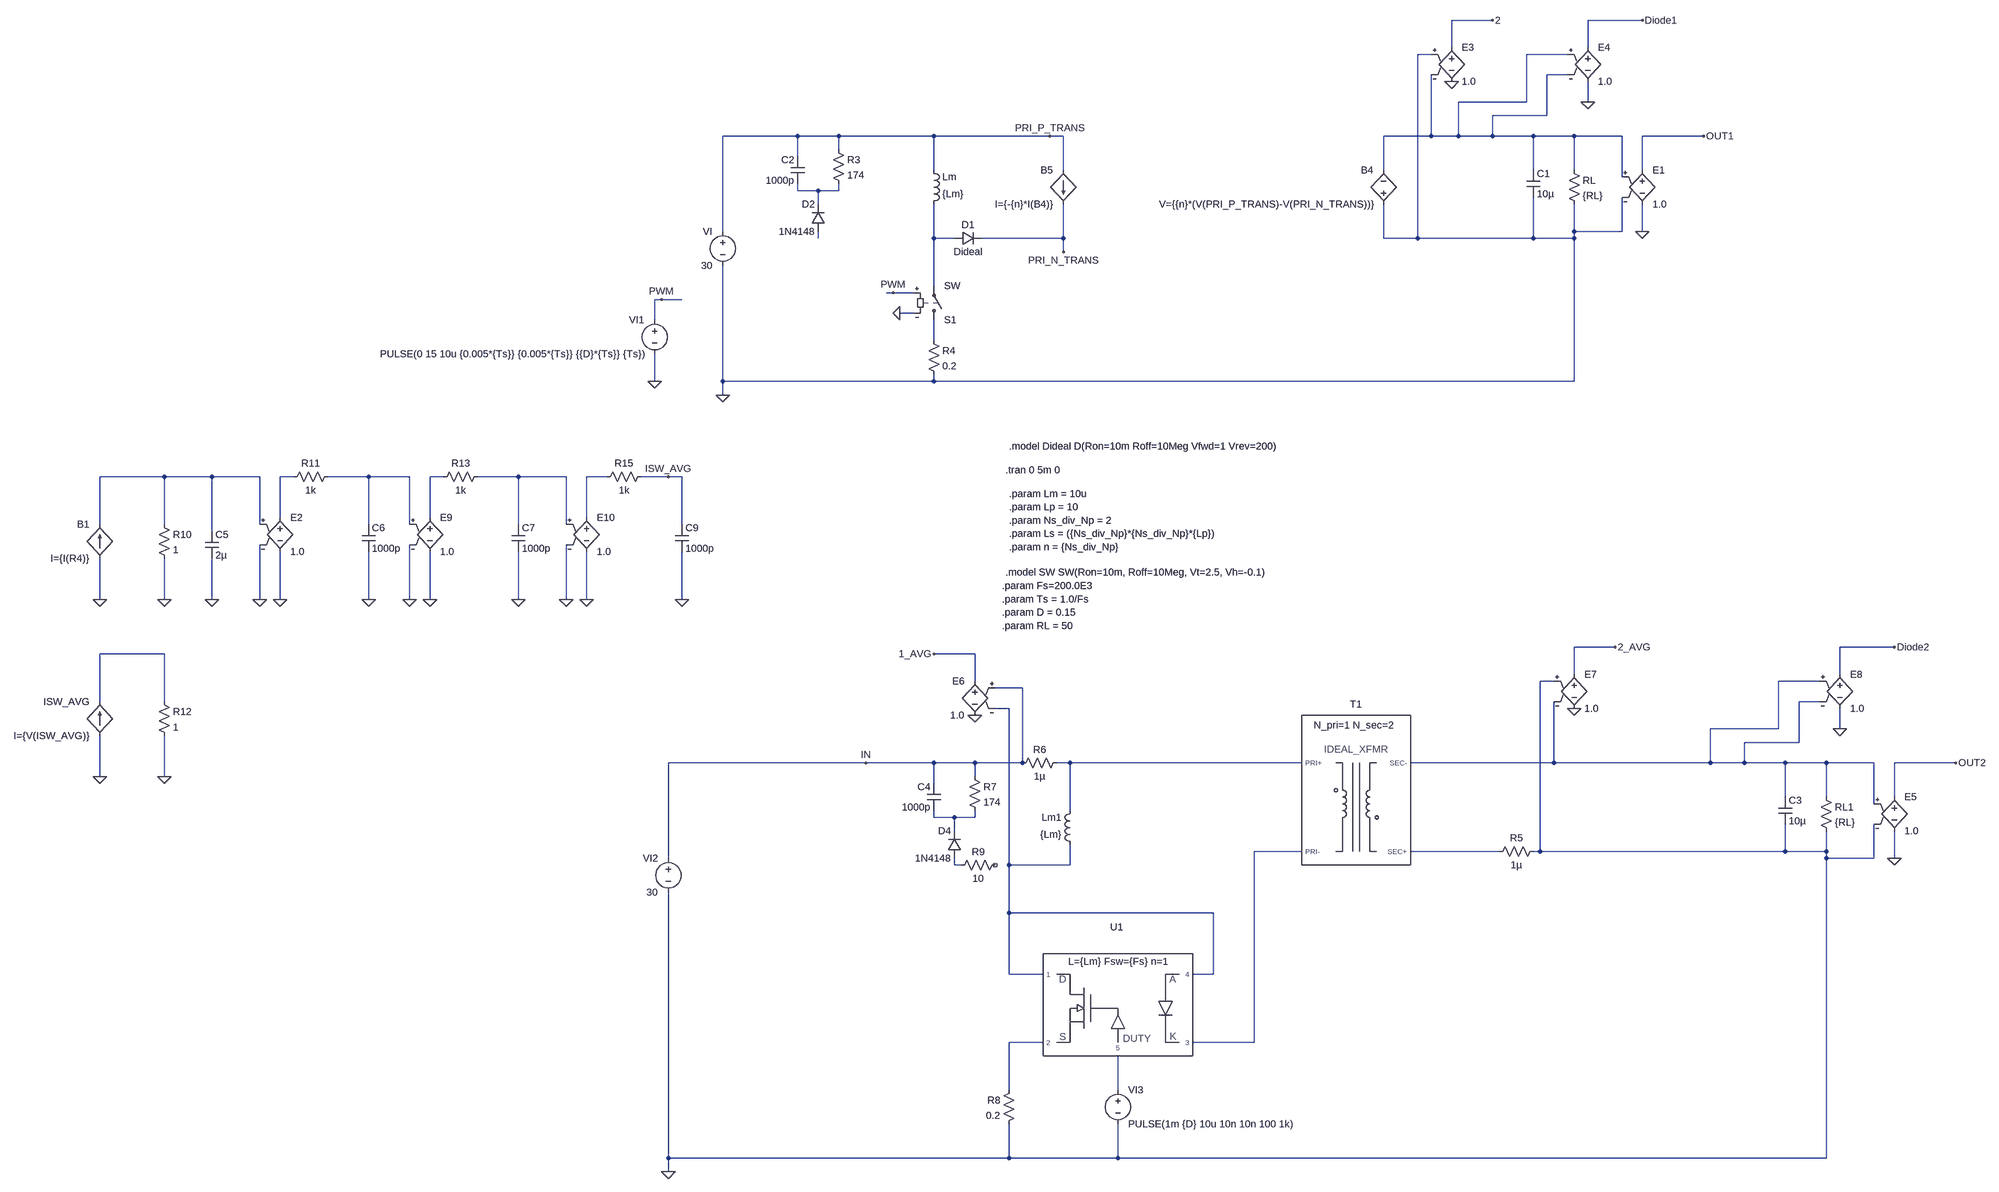
[diagram p0: schematic Flyback_Basic_Model_Diode_Moved_to_Primary_Side.asc]
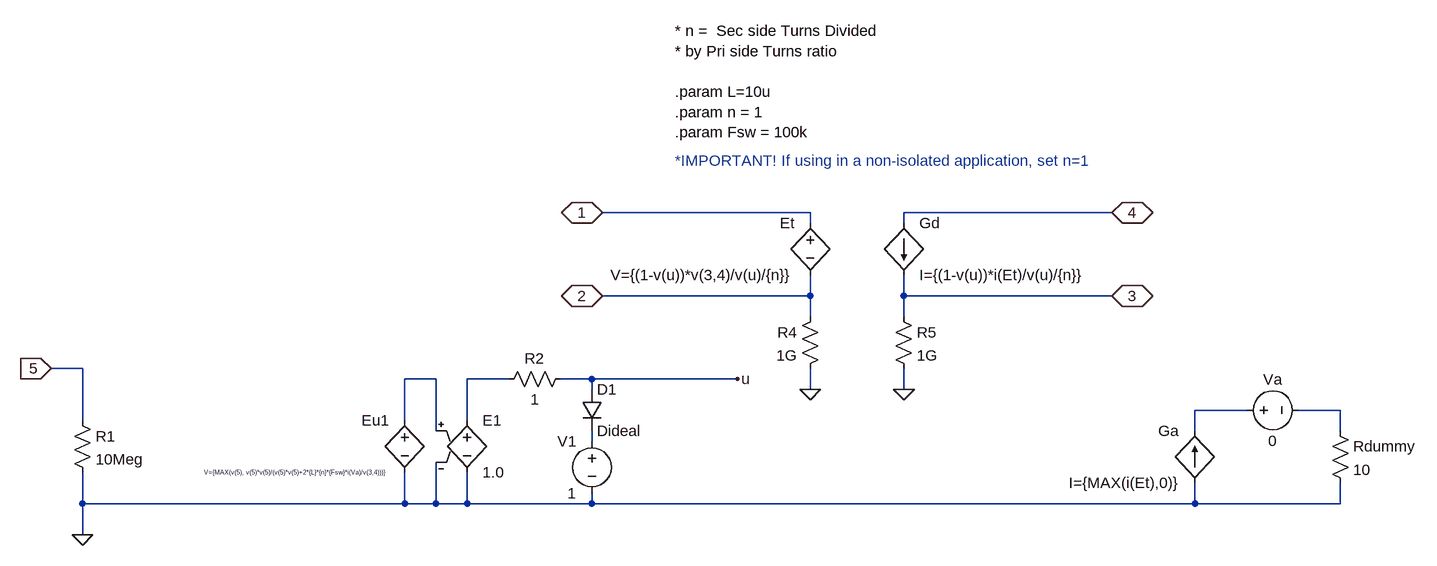
[diagram p1: sub-circuit ccm-dcm2.asc]
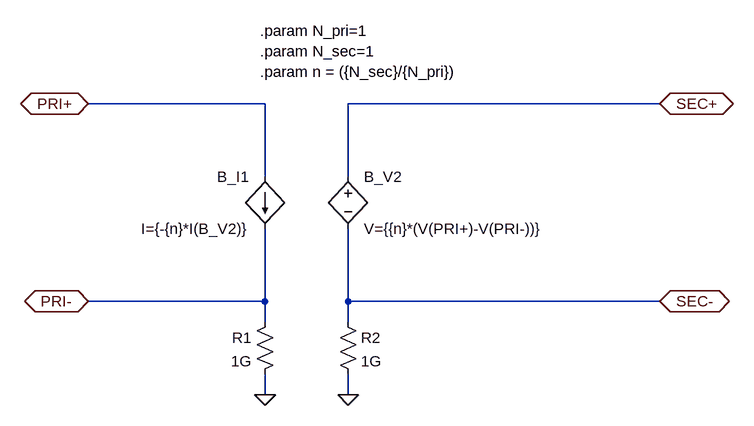
[diagram p2: sub-circuit ideal_dc_xfmr_alt.asc]
Flyback_Basic_Model_Diode_Moved_to_Primary_Side.asc, the LTspice schematic file:
Version 4.1
SHEET 1 2000 3524
WIRE 832 -288 736 -288
WIRE 1184 -288 1056 -288
WIRE 736 -224 736 -288
WIRE 1056 -224 1056 -288
WIRE 688 -208 656 -208
WIRE 1008 -208 912 -208
WIRE 1008 -160 960 -160
WIRE 912 -96 912 -208
WIRE 912 -96 752 -96
WIRE 1056 -96 1056 -144
WIRE 960 -64 960 -160
WIRE 960 -64 832 -64
WIRE -800 -16 -976 -16
WIRE -704 -16 -800 -16
WIRE -480 -16 -704 -16
WIRE -208 -16 -480 -16
WIRE -176 -16 -208 -16
WIRE 688 -16 688 -160
WIRE 688 -16 576 -16
WIRE 752 -16 752 -96
WIRE 752 -16 688 -16
WIRE 832 -16 832 -64
WIRE 832 -16 752 -16
WIRE 928 -16 832 -16
WIRE 1024 -16 928 -16
WIRE 1136 -16 1024 -16
WIRE 1328 -16 1184 -16
WIRE -704 16 -704 -16
WIRE -800 32 -800 -16
WIRE -480 64 -480 -16
WIRE -176 64 -176 -16
WIRE 576 64 576 -16
WIRE 928 64 928 -16
WIRE 1024 64 1024 -16
WIRE 1184 64 1184 -16
WIRE 1136 80 1136 -16
WIRE -800 112 -800 96
WIRE -752 112 -800 112
WIRE -704 112 -704 96
WIRE -704 112 -752 112
WIRE -752 144 -752 112
WIRE -976 208 -976 -16
WIRE 1024 208 1024 144
WIRE 1136 208 1136 128
WIRE 1136 208 1024 208
WIRE 1184 208 1184 144
WIRE -752 224 -752 208
WIRE -480 224 -480 144
WIRE -432 224 -480 224
WIRE -176 224 -176 144
WIRE -176 224 -368 224
WIRE 576 224 576 144
WIRE 656 224 656 -208
WIRE 656 224 576 224
WIRE 928 224 928 128
WIRE 928 224 656 224
WIRE 1024 224 1024 208
WIRE 1024 224 928 224
WIRE -176 256 -176 224
WIRE -480 336 -480 224
WIRE -576 352 -592 352
WIRE -528 352 -576 352
WIRE -1120 368 -1136 368
WIRE -1072 368 -1120 368
WIRE -528 400 -560 400
WIRE -1136 416 -1136 368
WIRE -480 464 -480 416
WIRE -1136 560 -1136 496
WIRE -976 560 -976 288
WIRE -480 560 -480 544
WIRE -480 560 -976 560
WIRE 1024 560 1024 224
WIRE 1024 560 -480 560
WIRE -976 592 -976 560
WIRE -2288 784 -2448 784
WIRE -2176 784 -2288 784
WIRE -2064 784 -2176 784
WIRE -1984 784 -2016 784
WIRE -1808 784 -1904 784
WIRE -1712 784 -1808 784
WIRE -1632 784 -1664 784
WIRE -1456 784 -1552 784
WIRE -1344 784 -1456 784
WIRE -1248 784 -1296 784
WIRE -1104 784 -1168 784
WIRE -1072 784 -1104 784
WIRE -2016 880 -2016 784
WIRE -1664 880 -1664 784
WIRE -1296 880 -1296 784
WIRE -2448 896 -2448 784
WIRE -2288 896 -2288 784
WIRE -2064 896 -2064 784
WIRE -1808 896 -1808 784
WIRE -1712 896 -1712 784
WIRE -1456 896 -1456 784
WIRE -1344 896 -1344 784
WIRE -1072 896 -1072 784
WIRE -2176 912 -2176 784
WIRE -2448 1072 -2448 976
WIRE -2288 1072 -2288 976
WIRE -2176 1072 -2176 976
WIRE -2064 1072 -2064 944
WIRE -2016 1072 -2016 960
WIRE -1808 1072 -1808 960
WIRE -1712 1072 -1712 944
WIRE -1664 1072 -1664 960
WIRE -1456 1072 -1456 960
WIRE -1344 1072 -1344 944
WIRE -1296 1072 -1296 960
WIRE -1072 1072 -1072 960
WIRE 1120 1184 1024 1184
WIRE 1776 1184 1648 1184
WIRE -2288 1200 -2448 1200
WIRE -384 1200 -480 1200
WIRE 1024 1248 1024 1184
WIRE 1648 1248 1648 1184
WIRE -384 1264 -384 1200
WIRE 976 1264 944 1264
WIRE 1600 1264 1504 1264
WIRE -272 1280 -336 1280
WIRE -2448 1312 -2448 1200
WIRE -2288 1312 -2288 1200
WIRE 1600 1312 1552 1312
WIRE -304 1328 -336 1328
WIRE 1504 1376 1504 1264
WIRE 1504 1376 1344 1376
WIRE 1648 1376 1648 1328
WIRE 1552 1408 1552 1312
WIRE 1552 1408 1424 1408
WIRE -640 1456 -1104 1456
WIRE -480 1456 -640 1456
WIRE -384 1456 -480 1456
WIRE -272 1456 -272 1280
WIRE -272 1456 -384 1456
WIRE -160 1456 -192 1456
WIRE 384 1456 -160 1456
WIRE 976 1456 976 1312
WIRE 976 1456 640 1456
WIRE 1344 1456 1344 1376
WIRE 1344 1456 976 1456
WIRE 1424 1456 1424 1408
WIRE 1424 1456 1344 1456
WIRE 1520 1456 1424 1456
WIRE 1616 1456 1520 1456
WIRE 1728 1456 1616 1456
WIRE 1920 1456 1776 1456
WIRE -2448 1488 -2448 1392
WIRE -2288 1488 -2288 1392
WIRE -384 1488 -384 1456
WIRE -480 1504 -480 1456
WIRE 1520 1536 1520 1456
WIRE 1616 1536 1616 1456
WIRE 1776 1536 1776 1456
WIRE 1728 1552 1728 1456
WIRE -160 1568 -160 1456
WIRE -480 1584 -480 1568
WIRE -432 1584 -480 1584
WIRE -384 1584 -384 1568
WIRE -384 1584 -432 1584
WIRE -432 1616 -432 1584
WIRE 384 1664 272 1664
WIRE 848 1664 640 1664
WIRE 944 1664 944 1264
WIRE 944 1664 928 1664
WIRE 1520 1664 1520 1600
WIRE 1520 1664 944 1664
WIRE 1616 1664 1616 1616
WIRE 1616 1664 1520 1664
WIRE -1104 1680 -1104 1456
WIRE 1616 1680 1616 1664
WIRE 1728 1680 1728 1600
WIRE 1728 1680 1616 1680
WIRE 1776 1680 1776 1616
WIRE -432 1696 -432 1680
WIRE -416 1696 -432 1696
WIRE -304 1696 -304 1328
WIRE -160 1696 -160 1648
WIRE -160 1696 -304 1696
WIRE -304 1808 -304 1696
WIRE 176 1808 -304 1808
WIRE -304 1952 -304 1808
WIRE -224 1952 -304 1952
WIRE 176 1952 176 1808
WIRE 176 1952 128 1952
WIRE -224 2112 -304 2112
WIRE 272 2112 272 1664
WIRE 272 2112 128 2112
WIRE -304 2224 -304 2112
WIRE -48 2224 -48 2144
WIRE -1104 2384 -1104 1760
WIRE -304 2384 -304 2304
WIRE -304 2384 -1104 2384
WIRE -48 2384 -48 2304
WIRE -48 2384 -304 2384
WIRE 1616 2384 1616 1680
WIRE 1616 2384 -48 2384
WIRE -1104 2416 -1104 2384
FLAG -976 592 0
FLAG 1184 208 0
FLAG 1328 -16 OUT1
FLAG 736 -144 0
FLAG 832 -288 2
FLAG 1056 -96 0
FLAG 1184 -288 Diode1
FLAG -1104 2416 0
FLAG 1776 1680 0
FLAG 1920 1456 OUT2
FLAG -384 1344 0
FLAG 1024 1328 0
FLAG -480 1200 1_AVG
FLAG 1120 1184 2_AVG
FLAG -640 1456 IN
FLAG 1648 1376 0
FLAG 1776 1184 Diode2
FLAG -1120 368 PWM
FLAG -1136 560 0
FLAG -560 400 0
FLAG -576 352 PWM
FLAG -2176 1072 0
FLAG -2448 1072 0
FLAG -2288 1072 0
FLAG -2064 1072 0
FLAG -2016 1072 0
FLAG -1808 1072 0
FLAG -2448 1488 0
FLAG -2288 1488 0
FLAG -1104 784 ISW_AVG
FLAG -1712 1072 0
FLAG -1664 1072 0
FLAG -1456 1072 0
FLAG -1344 1072 0
FLAG -1296 1072 0
FLAG -1072 1072 0
FLAG -208 -16 PRI_P_TRANS
FLAG -176 256 PRI_N_TRANS
SYMBOL voltage -976 192 M0
WINDOW 123 0 0 Left 0
WINDOW 39 0 0 Left 0
SYMATTR InstName VI
SYMATTR Value 30
SYMBOL voltage -1136 400 M0
WINDOW 123 0 0 Left 0
WINDOW 39 0 0 Left 0
SYMATTR InstName VI1
SYMATTR Value PULSE(0 15 10u {0.005*{Ts}} {0.005*{Ts}} {{D}*{Ts}} {Ts})
SYMBOL res 1008 48 R0
SYMATTR InstName RL
SYMATTR Value {RL}
SYMBOL cap 912 64 R0
SYMATTR InstName C1
SYMATTR Value 10µ
SYMBOL diode -432 208 M90
WINDOW 0 0 32 VBottom 2
WINDOW 3 32 32 VTop 2
SYMATTR InstName D1
SYMATTR Value Dideal
SYMBOL e 1184 48 R0
SYMATTR InstName E1
SYMATTR Value 1.0
SYMBOL e 736 -240 R0
SYMATTR InstName E3
SYMATTR Value 1.0
SYMBOL sw -480 432 M180
SYMATTR InstName S1
SYMBOL diode -736 208 R180
WINDOW 0 24 64 Left 2
WINDOW 3 24 0 Left 2
SYMATTR InstName D2
SYMATTR Value 1N4148
SYMBOL cap -784 32 M0
SYMATTR InstName C2
SYMATTR Value 1000p
SYMBOL res -720 0 R0
SYMATTR InstName R3
SYMATTR Value 174
SYMBOL e 1056 -240 R0
SYMATTR InstName E4
SYMATTR Value 1.0
SYMBOL voltage -1104 1664 M0
WINDOW 123 0 0 Left 0
WINDOW 39 0 0 Left 0
SYMATTR InstName VI2
SYMATTR Value 30
SYMBOL res 1600 1520 R0
SYMATTR InstName RL1
SYMATTR Value {RL}
SYMBOL cap 1504 1536 R0
SYMATTR InstName C3
SYMATTR Value 10µ
SYMBOL e 1776 1520 R0
SYMATTR InstName E5
SYMATTR Value 1.0
SYMBOL res 944 1648 R90
WINDOW 0 0 56 VBottom 2
WINDOW 3 32 56 VTop 2
SYMATTR InstName R5
SYMATTR Value 1µ
SYMBOL res -288 1472 R270
WINDOW 0 32 56 VTop 2
WINDOW 3 0 56 VBottom 2
SYMATTR InstName R6
SYMATTR Value 1µ
SYMBOL e -384 1248 M0
SYMATTR InstName E6
SYMATTR Value 1.0
SYMBOL e 1024 1232 R0
SYMATTR InstName E7
SYMATTR Value 1.0
SYMBOL diode -416 1680 R180
WINDOW 0 24 64 Left 2
WINDOW 3 24 0 Left 2
SYMATTR InstName D4
SYMATTR Value 1N4148
SYMBOL cap -464 1504 M0
SYMATTR InstName C4
SYMATTR Value 1000p
SYMBOL res -400 1472 R0
SYMATTR InstName R7
SYMATTR Value 174
SYMBOL e 1648 1232 R0
SYMATTR InstName E8
SYMATTR Value 1.0
SYMBOL ccm-dcm2 -48 2032 R0
WINDOW 39 1 -94 Bottom 2
SYMATTR SpiceLine L={Lm} Fsw={Fs} n=1
SYMATTR InstName U1
SYMBOL voltage -48 2208 R0
WINDOW 123 0 0 Left 0
WINDOW 39 0 0 Left 0
SYMATTR InstName VI3
SYMATTR Value PULSE(1m {D} 10u 10n 10n 100 1k)
SYMBOL res -288 2208 M0
SYMATTR InstName R8
SYMATTR Value 0.2
SYMBOL res -320 1680 R90
WINDOW 0 0 56 VBottom 2
WINDOW 3 32 56 VTop 2
SYMATTR InstName R9
SYMATTR Value 10
SYMBOL ind -496 160 M180
WINDOW 0 36 80 Left 2
WINDOW 3 36 40 Left 2
SYMATTR InstName Lm
SYMATTR Value {Lm}
SYMBOL ind -144 1664 R180
WINDOW 0 36 80 Left 2
WINDOW 3 36 40 Left 2
SYMATTR InstName Lm1
SYMATTR Value {Lm}
SYMBOL res -496 448 R0
SYMATTR InstName R4
SYMATTR Value 0.2
SYMBOL bi -2448 976 R180
WINDOW 0 24 80 Left 2
WINDOW 3 24 0 Left 2
SYMATTR InstName B1
SYMATTR Value I={I(R4)}
SYMBOL res -2304 880 R0
SYMATTR InstName R10
SYMATTR Value 1
SYMBOL cap -2192 912 R0
SYMATTR InstName C5
SYMATTR Value 2µ
SYMBOL e -2016 864 R0
SYMATTR InstName E2
SYMATTR Value 1.0
SYMBOL res -1888 768 R90
WINDOW 0 0 56 VBottom 2
WINDOW 3 32 56 VTop 2
SYMATTR InstName R11
SYMATTR Value 1k
SYMBOL cap -1824 896 R0
SYMATTR InstName C6
SYMATTR Value 1000p
SYMBOL bi -2448 1392 R180
WINDOW 0 24 80 Left 2
WINDOW 3 24 0 Left 2
SYMATTR InstName ISW_AVG
SYMATTR Value I={V(ISW_AVG)}
SYMBOL res -2304 1296 R0
SYMATTR InstName R12
SYMATTR Value 1
SYMBOL e -1664 864 R0
SYMATTR InstName E9
SYMATTR Value 1.0
SYMBOL res -1536 768 R90
WINDOW 0 0 56 VBottom 2
WINDOW 3 32 56 VTop 2
SYMATTR InstName R13
SYMATTR Value 1k
SYMBOL cap -1472 896 R0
SYMATTR InstName C7
SYMATTR Value 1000p
SYMBOL e -1296 864 R0
SYMATTR InstName E10
SYMATTR Value 1.0
SYMBOL res -1152 768 R90
WINDOW 0 0 56 VBottom 2
WINDOW 3 32 56 VTop 2
SYMATTR InstName R15
SYMATTR Value 1k
SYMBOL cap -1088 896 R0
SYMATTR InstName C9
SYMATTR Value 1000p
SYMBOL bv 576 160 R180
WINDOW 0 24 96 Left 2
WINDOW 3 24 16 Left 2
SYMATTR InstName B4
SYMATTR Value V={{n}*(V(PRI_P_TRANS)-V(PRI_N_TRANS))}
SYMBOL bi -176 64 M0
SYMATTR InstName B5
SYMATTR Value I={-{n}*I(B4)}
SYMBOL IDEAL_DC_XFMR_ALT 512 1552 R0
WINDOW 0 -1 -218 Bottom 2
WINDOW 39 -6 -169 Bottom 2
SYMATTR InstName T1
SYMATTR SpiceLine N_pri=1 N_sec=2
TEXT -312 768 Left 2 !.tran 0 5m 0
TEXT -312 1008 Left 2 !.model SW SW(Ron=10m, Roff=10Meg, Vt=2.5, Vh=-0.1)
TEXT -320 1040 Left 2 !.param Fs=200.0E3\n.param Ts = 1.0/Fs\n.param D = 0.15\n.param RL = 50
TEXT -304 712 Left 2 !.model Dideal D(Ron=10m Roff=10Meg Vfwd=1 Vrev=200)
TEXT -304 824 Left 2 !.param Lm = 10u\n.param Lp = 10\n.param Ns_div_Np = 2\n.param Ls = ({Ns_div_Np}*{Ns_div_Np}*{Lp})\n.param n = {Ns_div_Np}

ccm-dcm2.asc, the sub-circuit schematic file:
Version 4.1
SHEET 1 1388 680
WIRE 432 -224 112 -224
WIRE 896 -224 576 -224
WIRE 432 -208 432 -224
WIRE 576 -208 576 -224
WIRE 432 -96 432 -128
WIRE 432 -96 112 -96
WIRE 576 -96 576 -128
WIRE 896 -96 576 -96
WIRE 432 -64 432 -96
WIRE 576 -64 576 -96
WIRE -688 16 -736 16
WIRE -144 32 -192 32
WIRE -32 32 -96 32
WIRE 96 32 48 32
WIRE 320 32 96 32
WIRE 96 48 96 32
WIRE 432 48 432 16
WIRE 576 48 576 16
WIRE 1104 80 1024 80
WIRE 1248 80 1184 80
WIRE -688 96 -688 16
WIRE -192 96 -192 32
WIRE -96 96 -96 32
WIRE -144 112 -144 32
WIRE 1024 112 1024 80
WIRE 1248 112 1248 80
WIRE 96 128 96 112
WIRE -688 224 -688 176
WIRE -192 224 -192 176
WIRE -192 224 -688 224
WIRE -144 224 -144 160
WIRE -144 224 -192 224
WIRE -96 224 -96 176
WIRE -96 224 -144 224
WIRE 96 224 96 208
WIRE 96 224 -96 224
WIRE 1024 224 1024 192
WIRE 1024 224 96 224
WIRE 1248 224 1248 192
WIRE 1248 224 1024 224
WIRE -688 272 -688 224
FLAG -736 16 5
IOPIN -736 16 In
FLAG 320 32 u
FLAG 896 -224 4
IOPIN 896 -224 BiDir
FLAG 896 -96 3
IOPIN 896 -96 BiDir
FLAG 112 -224 1
IOPIN 112 -224 BiDir
FLAG 112 -96 2
IOPIN 112 -96 BiDir
FLAG -688 272 0
FLAG 432 48 0
FLAG 576 48 0
SYMBOL bv -192 80 M0
WINDOW 3 24 96 Left 0
SYMATTR Value V={MAX(v(5), v(5)*v(5)/(v(5)*v(5)+2*{L}*{n}*{Fsw}*i(Va)/v(3,4)))}
SYMATTR InstName Eu1
SYMBOL bv 432 -224 M0
SYMATTR InstName Et
SYMATTR Value V={(1-v(u))*v(3,4)/v(u)/{n}}
SYMBOL bi 576 -208 R0
SYMATTR InstName Gd
SYMATTR Value I={(1-v(u))*i(Et)/v(u)/{n}}
SYMBOL bi 1024 192 R180
WINDOW 0 24 80 Left 2
WINDOW 3 24 0 Left 2
SYMATTR InstName Ga
SYMATTR Value I={MAX(i(Et),0)}
SYMBOL voltage 1088 80 R270
WINDOW 0 32 56 VTop 2
WINDOW 3 -32 56 VBottom 2
WINDOW 123 0 0 Left 0
WINDOW 39 0 0 Left 0
SYMATTR InstName Va
SYMATTR Value 0
SYMBOL res 1232 96 R0
SYMATTR InstName Rdummy
SYMATTR Value 10
SYMBOL e -96 80 R0
SYMATTR InstName E1
SYMATTR Value 1.0
SYMBOL res 64 16 R90
WINDOW 0 0 56 VBottom 2
WINDOW 3 32 56 VTop 2
SYMATTR InstName R2
SYMATTR Value 1
SYMBOL diode 80 48 R0
SYMATTR InstName D1
SYMATTR Value Dideal
SYMBOL voltage 96 112 M0
WINDOW 123 0 0 Left 0
WINDOW 39 0 0 Left 0
SYMATTR InstName V1
SYMATTR Value 1
SYMBOL res -704 80 R0
SYMATTR InstName R1
SYMATTR Value 10Meg
SYMBOL res 448 -80 M0
SYMATTR InstName R4
SYMATTR Value 1G
SYMBOL res 560 -80 R0
SYMATTR InstName R5
SYMATTR Value 1G
TEXT 224 -504 Left 2 !* n =  Sec side Turns Divided\n* by Pri side Turns ratio\n \n.param L=10u\n.param n = 1\n.param Fsw = 100k
TEXT 224 -304 Left 2 ;*IMPORTANT! If using in a non-isolated application, set n=1

ideal_dc_xfmr_alt.asc, the sub-circuit schematic file:
Version 4.1
SHEET 1 996 680
WIRE 192 112 -80 112
WIRE 800 112 320 112
WIRE 192 224 192 112
WIRE 320 224 320 112
WIRE 192 416 192 304
WIRE 192 416 -80 416
WIRE 320 416 320 304
WIRE 800 416 320 416
WIRE 192 448 192 416
WIRE 320 448 320 416
WIRE 192 560 192 528
WIRE 320 560 320 528
FLAG -80 112 PRI+
IOPIN -80 112 BiDir
FLAG -80 416 PRI-
IOPIN -80 416 BiDir
FLAG 800 112 SEC+
IOPIN 800 112 BiDir
FLAG 800 416 SEC-
IOPIN 800 416 BiDir
FLAG 320 560 0
FLAG 192 560 0
SYMBOL bv 320 208 R0
SYMATTR InstName B_V2
SYMATTR Value V={{n}*(V(PRI+)-V(PRI-))}
SYMBOL bi 192 224 M0
SYMATTR InstName B_I1
SYMATTR Value I={-{n}*I(B_V2)}
SYMBOL res 208 432 M0
SYMATTR InstName R1
SYMATTR Value 1G
SYMBOL res 304 432 R0
SYMATTR InstName R2
SYMATTR Value 1G
TEXT 184 0 Left 2 !.param N_pri=1\n.param N_sec=1\n.param n = ({N_sec}/{N_pri})

The netlist it stands for:
* Flyback_Basic_Model_Diode_Moved_to_Primary_Side.asc
VI PRI_P_TRANS 0 30
VI1 PWM 0 PULSE(0 15 10u {0.005*{Ts}} {0.005*{Ts}} {{D}*{Ts}} {Ts})
RL N001 0 {RL}
C1 N001 0 10µ
D1 N004 PRI_N_TRANS Dideal
E1 OUT1 0 N001 0 1.0
E3 2 0 0 N001 1.0
S1 N005 N004 PWM 0 SW
D2 N003 N002 1N4148
C2 PRI_P_TRANS N002 1000p
R3 PRI_P_TRANS N002 174
E4 Diode1 0 N001 N001 1.0
VI2 IN 0 30
RL1 N013 0 {RL}
C3 N013 0 10µ
E5 OUT2 0 N013 0 1.0
R5 0 N018 1µ
R6 IN N015 1µ
E6 1_AVG 0 IN N014 1.0
E7 2_AVG 0 0 N013 1.0
D4 N019 N016 1N4148
C4 IN N016 1000p
R7 IN N016 174
E8 Diode2 0 N013 N013 1.0
X§U1 N021 N014 N020 N017 N014 ccm-dcm2 params: L={Lm} Fsw={Fs} n=1
VI3 N021 0 PULSE(1m {D} 10u 10n 10n 100 1k)
R8 N020 0 0.2
R9 NC_01 N019 10
Lm N004 PRI_P_TRANS {Lm}
Lm1 N014 N015 {Lm}
R4 N005 0 0.2
B1 0 N006 I={I(R4)}
R10 N006 0 1
C5 N006 0 2µ
E2 N007 0 N006 0 1.0
R11 N008 N007 1k
C6 N008 0 1000p
B§ISW_AVG 0 N012 I={V(ISW_AVG)}
R12 N012 0 1
E9 N009 0 N008 0 1.0
R13 N010 N009 1k
C7 N010 0 1000p
E10 N011 0 N010 0 1.0
R15 ISW_AVG N011 1k
C9 ISW_AVG 0 1000p
B4 0 N001 V={{n}*(V(PRI_P_TRANS)-V(PRI_N_TRANS))}
B5 PRI_P_TRANS PRI_N_TRANS I={-{n}*I(B4)}
X§T1 N015 N017 N018 N013 ideal_dc_xfmr_alt params: N_pri=1 N_sec=2

* block symbol definitions
.subckt ccm-dcm2 5 1 2 3 4
B§Eu1 N001 0 V={MAX(v(5), v(5)*v(5)/(v(5)*v(5)+2*{L}*{n}*{Fsw}*i(Va)/v(3,4)))}
B§Et 1 2 V={(1-v(u))*v(3,4)/v(u)/{n}}
B§Gd 4 3 I={(1-v(u))*i(Et)/v(u)/{n}}
B§Ga 0 N003 I={MAX(i(Et),0)}
Va N003 N004 0
Rdummy N004 0 10
E1 N002 0 N001 0 1.0
R2 u N002 1
D1 u N005 Dideal
V1 N005 0 1
R1 5 0 10Meg
R4 2 0 1G
R5 3 0 1G
* n =  Sec side Turns Divided
* by Pri side Turns ratio
.param L=10u
.param n = 1
.param Fsw = 100k
* *IMPORTANT! If using in a non-isolated application, set n=1
.ends ccm-dcm2

.subckt ideal_dc_xfmr_alt PRI+ PRI- SEC+ SEC-
B_V2 SEC+ SEC- V={{n}*(V(PRI+)-V(PRI-))}
B_I1 PRI+ PRI- I={-{n}*I(B_V2)}
R1 PRI- 0 1G
R2 SEC- 0 1G
.param N_pri=1
.param N_sec=1
.param n = ({N_sec}/{N_pri})
.ends ideal_dc_xfmr_alt

.model D D
.lib standard.dio
.tran 0 5m 0
.model SW SW(Ron=10m, Roff=10Meg, Vt=2.5, Vh=-0.1)
.param Fs=200.0E3
.param Ts = 1.0/Fs
.param D = 0.15
.param RL = 50
.model Dideal D(Ron=10m Roff=10Meg Vfwd=1 Vrev=200)
.param Lm = 10u
.param Lp = 10
.param Ns_div_Np = 2
.param Ls = ({Ns_div_Np}*{Ns_div_Np}*{Lp})
.param n = {Ns_div_Np}
.backanno
.end